# Altium schematic sheet [17]-FPGA_Power_Supply.SchDoc
size A4
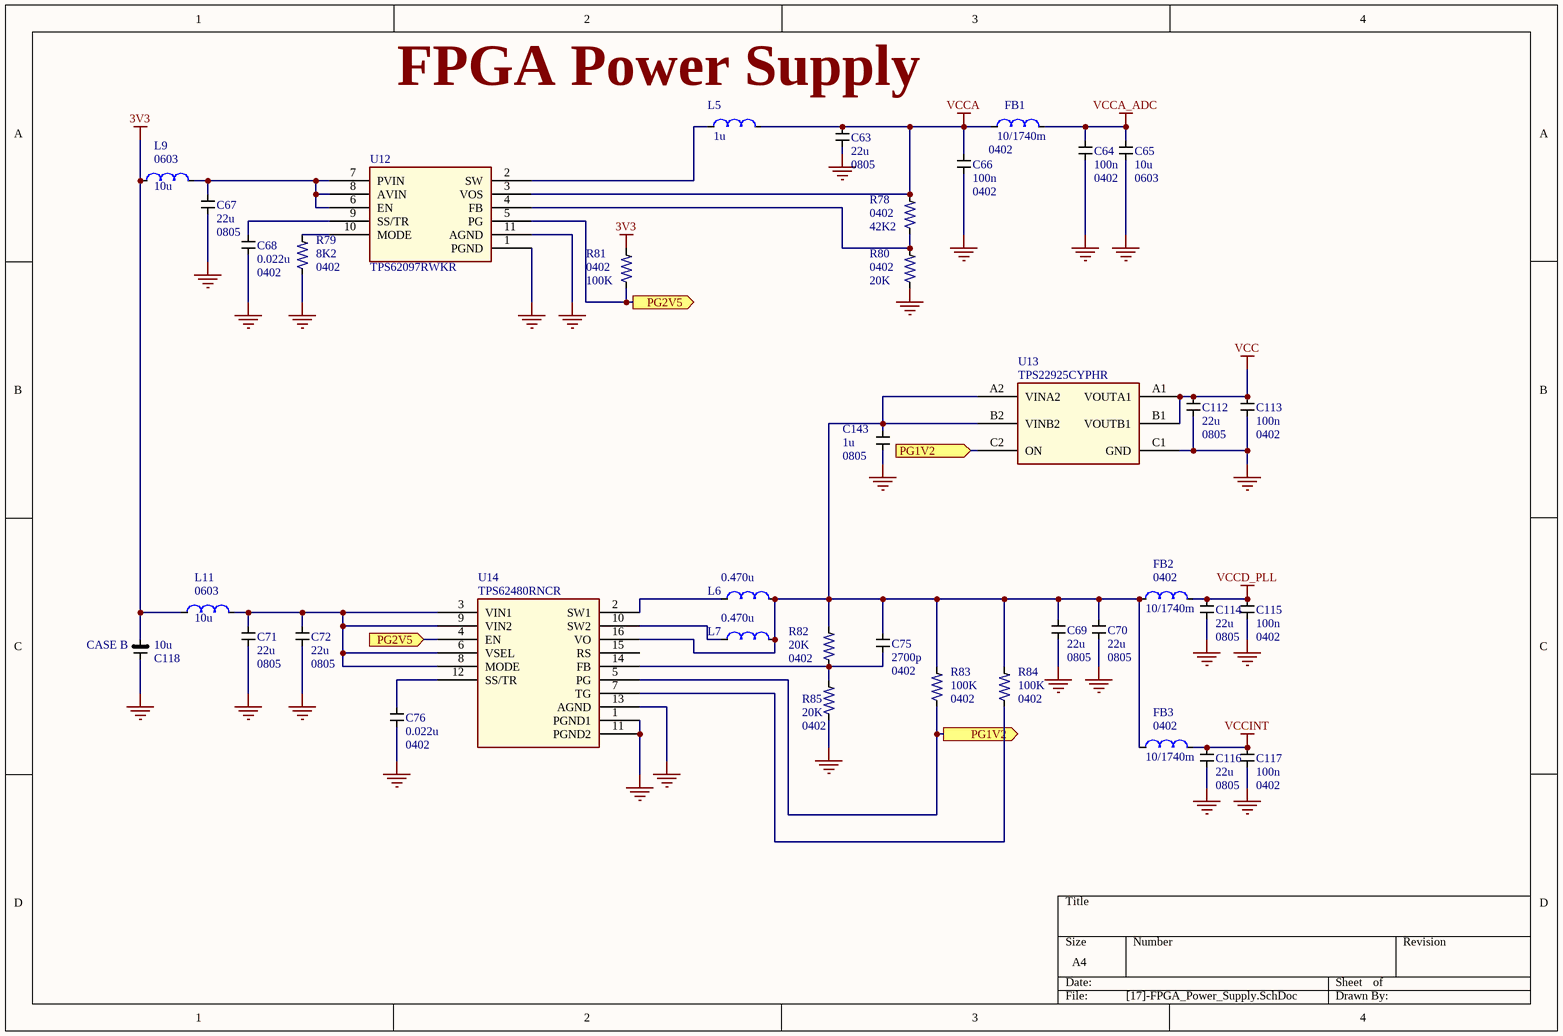
[diagram p0: [17]-FPGA_Power_Supply.SchDoc]

## Parts
C63  22u  PCB Package: 0805  [*CAPC2013X140N]
C64  100n  PCB Stake: 0402  [*CAPC1005X60N]
C65  10u  PCB footprint: 0603
C66  100n  PCB Stake: 0402  [*CAPC1005X60N]
C67  22u  PCB Package: 0805  [*CAPC2013X140N]
C68  0.022u  PCB Stake: 0402  [*CAPC1005X60N]
C69  22u  PCB Package: 0805  [*CAPC2013X140N]
C70  22u  PCB Package: 0805  [*CAPC2013X140N]
C71  22u  PCB Package: 0805  [*CAPC2013X140N]
C72  22u  PCB Package: 0805  [*CAPC2013X140N]
C75  2700p  PCB Stake: 0402  [*CAPC1005X60N]
C76  0.022u  PCB Stake: 0402  [*CAPC1005X60N]
C112  22u  PCB Package: 0805  [*CAPC2013X140N]
C113  100n  PCB Stake: 0402  [*CAPC1005X60N]
C114  22u  PCB Package: 0805  [*CAPC2013X140N]
C115  100n  PCB Stake: 0402  [*CAPC1005X60N]
C116  22u  PCB Package: 0805  [*CAPC2013X140N]
C117  100n  PCB Stake: 0402  [*CAPC1005X60N]
C118  10u  CASE: CASE B  [CAPC3529X21N]
C143  1u  PCB footprint: 0805
FB1  10/1740m  Package Type: 0402  [*CAPC1005X55N]
FB2  10/1740m  Package Type: 0402  [*CAPC1005X55N]
FB3  10/1740m  Package Type: 0402  [*CAPC1005X55N]
L5  1u  [*INDM4040X210]
L6  0.470u  [INDC3234X16N]
L7  0.470u  [INDC3234X16N]
L9  10u  PCB Layout:: 0603  [*INDC1608X95N]
L11  10u  PCB Layout:: 0603  [*INDC1608X95N]
R78  42K2  PCB footprint: 0402  [*R0402]
R79  8K2  PCB footprint: 0402  [*R0402]
R80  20K  PCB footprint: 0402  [*R0402]
R81  100K  PCB footprint: 0402  [*R0402]
R82  20K  PCB footprint: 0402  [*R0402]
R83  100K  PCB footprint: 0402  [*R0402]
R84  100K  PCB footprint: 0402  [*R0402]
R85  20K  PCB footprint: 0402  [*R0402]
U12  TPS62097RWKR  [PCBComponent_1 - duplicate1]
U13  TPS22925CYPHR  [BGA]
U14  TPS62480RNCR  [PCBComponent_1]

## Ports
PG1V2 (in), PG1V2 (out), PG2V5 (in), PG2V5 (out)

## Nets
3V3: C118.1 L9.1 L11.1 R81.2
GND: C63.1 C64.1 C65.1 C66.1 C67.1 C68.1 C69.1 C70.1 C71.1 C72.1 C76.1 C112.1 C113.1 C114.1 C115.1 C116.1 C117.1 C118.2 C143.1 R79.1 R80.1 R85.1 U12.1(PGND) U12.11(AGND) U13.C1(GND) U14.1(PGND1) U14.11(PGND2) U14.13(AGND)
VCC: C112.2 C113.2 U13.A1(VOUTA1) U13.B1(VOUTB1)
VCCA: C63.2 C66.2 FB1.1 L5.2 R78.2 U12.3(VOS)
VCCA_ADC: C64.2 C65.2 FB1.2
VCCD_PLL: C114.2 C115.2 FB2.2
VCCINT: C116.2 C117.2 FB3.2
PG1V2: R83.1 U13.C2(ON) U14.5(PG) ; port PG1V2
PG2V5: R81.1 U12.5(PG) U14.4(EN) ; port PG2V5
NetC67_2: C67.2 L9.2 U12.6(EN) U12.7(PVIN) U12.8(AVIN)
NetC68_2: C68.2 U12.9(SS/TR)
NetC69_2: C69.2 C70.2 C75.2 C143.2 FB2.1 FB3.1 L6.2 L7.2 R82.2 R83.2 R84.2 U13.A2(VINA2) U13.B2(VINB2) U14.16(VO)
NetC71_2: C71.2 C72.2 L11.2 U14.3(VIN1) U14.6(VSEL) U14.8(MODE) U14.9(VIN2)
NetC75_1: C75.1 R82.1 R85.2 U14.14(FB)
NetC76_2: C76.2 U14.12(SS/TR)
NetL5_1: L5.1 U12.2(SW)
NetL6_1: L6.1 U14.2(SW1)
NetL7_1: L7.1 U14.10(SW2)
NetR78_1: R78.1 R80.2 U12.4(FB)
NetR79_2: R79.2 U12.10(MODE)
NetR84_1: R84.1 U14.7(TG)

Not connected (* = marked no-connect by the designer): U14 15(RS)

## Notes on the sheet
- FPGA Power Supply

## Library data of the parts
C63-C72 C75 C76 C112-C118 C143 FB1-FB3 L5-L7 L9 L11 U12-U14 = Component_1
  C63 C67 C69-C72 C112 C114 C116: Buying URL:: https://uk.farnell.com/avx/08053d475kat2a/cap-4-7-f-25v-10-x5r-0805/dp/1657932?st=4.7u%200805
  C64 C66 C68 C75 C76 C113 C115 C117: Buying URL:: https://uk.farnell.com/avx/04023c104kat2a/cap-0-1-f-25v-10-x7r-0402/dp/1867948RL
  C65: Buying URL:: https://uk.farnell.com/avx/06031c104kat2a/cap-0-1-f-100v-10-x7r-0603/dp/2749806?st=100nf
  C118: Buying URL:: https://uk.farnell.com/avx/tajb107k006tnj/cap-tant-aec-q200-100uf-6-3v-case/dp/2893386?st=100u%20CASE%20B
  C143: Buying URL:: NEED TO BE ADDED
  FB1-FB3: Buying URL:: https://uk.farnell.com/murata/blm15ax100sn1d/ferrite-bead-0402-0-015ohm-1-74a/dp/2443220?st=BLM15AX100SN1D
  L5: Buying  URL: https://uk.farnell.com/coilcraft/xfl4020-102mec/inductor-1uh-11a-20-pwr-64mhz/dp/2289214?st=XFL4020-102ME; Package Type: 4x2x4mm
  L6 L7: Buying URL:: https://www.mouser.co.uk/ProductDetail/Coilcraft/XFL4015-471MEC?qs=zCSbvcPd3pYzCOJSVbeMnw==
  L9 L11: Buying URL:: https://uk.farnell.com/tdk/mlz1608m100wt/inductor-10uh-20-shielded/dp/2215635?st=10uH%200603
R78-R85 = RP73D1J76R8BTDG: Res Thin Film 0603 76.8 Ohm 0.1% 1/10W Â±15ppm/Â°C Molded SMD Paper T/R; Buying URL:: https://uk.farnell.com/yageo/rc0402fr-07100rl/res-100r-1-0-0625w-0402-thick/dp/9239111